# Altium schematic sheet buttonInput.SchDoc
size A
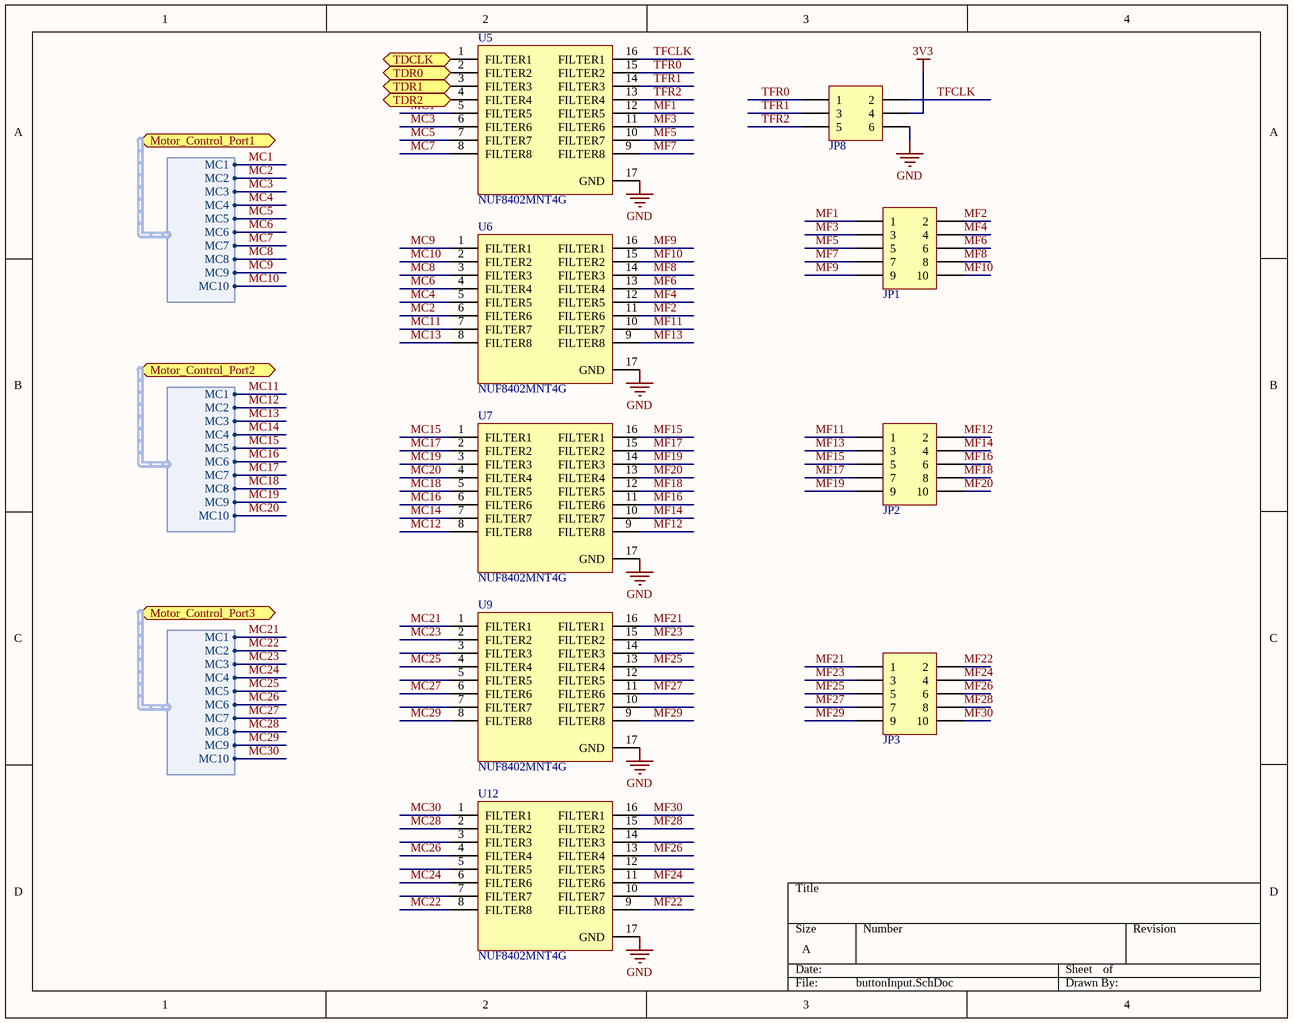
[diagram p0: buttonInput.SchDoc]

## Parts
JP1  Header 5x2 2.54mm  [2X5]  (value not drawn)
JP2  Header 5x2 2.54mm  [2X5]  (value not drawn)
JP3  Header 5x2 2.54mm  [2X5]  (value not drawn)
JP8  Header 3x2 2.54mm  [2X3]  (value not drawn)
U5  NUF8402MNT4G  [ONSC-DFN-16-506AC_V]
U6  NUF8402MNT4G  [ONSC-DFN-16-506AC_V]
U7  NUF8402MNT4G  [ONSC-DFN-16-506AC_V]
U9  NUF8402MNT4G  [ONSC-DFN-16-506AC_V]
U12  NUF8402MNT4G  [ONSC-DFN-16-506AC_V]

## Ports
Motor_Control_Port1 (harness MCP), Motor_Control_Port2 (harness MCP), Motor_Control_Port3 (harness MCP), TDCLK (bidir), TDR0 (bidir), TDR1 (bidir), TDR2 (bidir)

## Harnesses
MCP: MC1, MC2, MC3, MC4, MC5, MC6, MC7, MC8, MC9, MC10

## Nets
3V3: JP8.4
GND: JP8.6 U5.17(GND) U6.17(GND) U7.17(GND) U9.17(GND) U12.17(GND)
MC1: U5.5(FILTER5) ; port Motor_Control_Port1.MC1
MC2: U6.6(FILTER6) ; port Motor_Control_Port1.MC2
MC3: U5.6(FILTER6) ; port Motor_Control_Port1.MC3
MC4: U6.5(FILTER5) ; port Motor_Control_Port1.MC4
MC5: U5.7(FILTER7) ; port Motor_Control_Port1.MC5
MC6: U6.4(FILTER4) ; port Motor_Control_Port1.MC6
MC7: U5.8(FILTER8) ; port Motor_Control_Port1.MC7
MC8: U6.3(FILTER3) ; port Motor_Control_Port1.MC8
MC9: U6.1(FILTER1) ; port Motor_Control_Port1.MC9
MC10: U6.2(FILTER2) ; port Motor_Control_Port1.MC10
MC11: U6.7(FILTER7) ; port Motor_Control_Port2.MC1
MC12: U7.8(FILTER8) ; port Motor_Control_Port2.MC2
MC13: U6.8(FILTER8) ; port Motor_Control_Port2.MC3
MC14: U7.7(FILTER7) ; port Motor_Control_Port2.MC4
MC15: U7.1(FILTER1) ; port Motor_Control_Port2.MC5
MC16: U7.6(FILTER6) ; port Motor_Control_Port2.MC6
MC17: U7.2(FILTER2) ; port Motor_Control_Port2.MC7
MC18: U7.5(FILTER5) ; port Motor_Control_Port2.MC8
MC19: U7.3(FILTER3) ; port Motor_Control_Port2.MC9
MC20: U7.4(FILTER4) ; port Motor_Control_Port2.MC10
MC21: U9.1(FILTER1) ; port Motor_Control_Port3.MC1
MC22: U12.8(FILTER8) ; port Motor_Control_Port3.MC2
MC23: U9.2(FILTER2) ; port Motor_Control_Port3.MC3
MC24: U12.6(FILTER6) ; port Motor_Control_Port3.MC4
MC25: U9.4(FILTER4) ; port Motor_Control_Port3.MC5
MC26: U12.4(FILTER4) ; port Motor_Control_Port3.MC6
MC27: U9.6(FILTER6) ; port Motor_Control_Port3.MC7
MC28: U12.2(FILTER2) ; port Motor_Control_Port3.MC8
MC29: U9.8(FILTER8) ; port Motor_Control_Port3.MC9
MC30: U12.1(FILTER1) ; port Motor_Control_Port3.MC10
MF1: JP1.1 U5.12(FILTER5)
MF2: JP1.2 U6.11(FILTER6)
MF3: JP1.3 U5.11(FILTER6)
MF4: JP1.4 U6.12(FILTER5)
MF5: JP1.5 U5.10(FILTER7)
MF6: JP1.6 U6.13(FILTER4)
MF7: JP1.7 U5.9(FILTER8)
MF8: JP1.8 U6.14(FILTER3)
MF9: JP1.9 U6.16(FILTER1)
MF10: JP1.10 U6.15(FILTER2)
MF11: JP2.1 U6.10(FILTER7)
MF12: JP2.2 U7.9(FILTER8)
MF13: JP2.3 U6.9(FILTER8)
MF14: JP2.4 U7.10(FILTER7)
MF15: JP2.5 U7.16(FILTER1)
MF16: JP2.6 U7.11(FILTER6)
MF17: JP2.7 U7.15(FILTER2)
MF18: JP2.8 U7.12(FILTER5)
MF19: JP2.9 U7.14(FILTER3)
MF20: JP2.10 U7.13(FILTER4)
MF21: JP3.1 U9.16(FILTER1)
MF22: JP3.2 U12.9(FILTER8)
MF23: JP3.3 U9.15(FILTER2)
MF24: JP3.4 U12.11(FILTER6)
MF25: JP3.5 U9.13(FILTER4)
MF26: JP3.6 U12.13(FILTER4)
MF27: JP3.7 U9.11(FILTER6)
MF28: JP3.8 U12.15(FILTER2)
MF29: JP3.9 U9.9(FILTER8)
MF30: JP3.10 U12.16(FILTER1)
TDCLK: U5.1(FILTER1) ; port TDCLK
TDR0: U5.2(FILTER2) ; port TDR0
TDR1: U5.3(FILTER3) ; port TDR1
TDR2: U5.4(FILTER4) ; port TDR2
TFCLK: JP8.2 U5.16(FILTER1)
TFR0: JP8.1 U5.15(FILTER2)
TFR1: JP8.3 U5.14(FILTER3)
TFR2: JP8.5 U5.13(FILTER4)

Not connected (* = marked no-connect by the designer): U9 3(FILTER3) 5(FILTER5) 7(FILTER7) 10(FILTER7) 12(FILTER5) 14(FILTER3); U12 3(FILTER3) 5(FILTER5) 7(FILTER7) 10(FILTER7) 12(FILTER5) 14(FILTER3)

## Library data of the parts
JP1-JP3 = Header 5x2: Header, 8-Pin; Supplier 1: Farnell; Supplier Part Number 1: 1593440
JP8 = Header 3x2: Header, 6-Pin; Supplier 1: Digi-Key; Supplier 2: Mouser; Supplier Part Number 1: 952-1788-ND; Supplier Part Number 2: 855-M20-9980446
U5-U7 U9 U12 = CMP-1065-00001-1: 8-Channel EMI Filter with Integrated ESD Protection, -40 to 85 degC, 16-Pin DFN, Pb-Free, Tape and Reel; Manufacturer: On Semiconductor; V(BR) Typ (V): 7; Number of Lines: 8; VRWM Max (V): 5; ComponentLink3URL: http://www.onsemi.com/pub_link/Collateral/506AC.PDF; PackageVersion: Rev. D, 08/2013; RoHS: Pb-Free; ComponentLink2URL: http://www.onsemi.com/pub/Collateral/NUF8402MN-D.PDF; Packing: Tape and Reel; Mounting Technology: Surface Mount; ComponentLink1URL: http://www.onsemi.com/; PackageDescription: 16-Pin Small Outline No-Lead, Body 4 x 1.6 mm, Pitch 0.5 mm; DatasheetVersion: Rev. 7; ComponentLink3Description: Package Specification; PackageReference: DFN-16-506AC; ComponentLink2Description: Datasheet; ComponentLink1Description: Manufacturer URL; PartNumber: NUF8402MNT4G